# EAGLE design ProtoCAT_wireless (EAGLE 6.5.0)
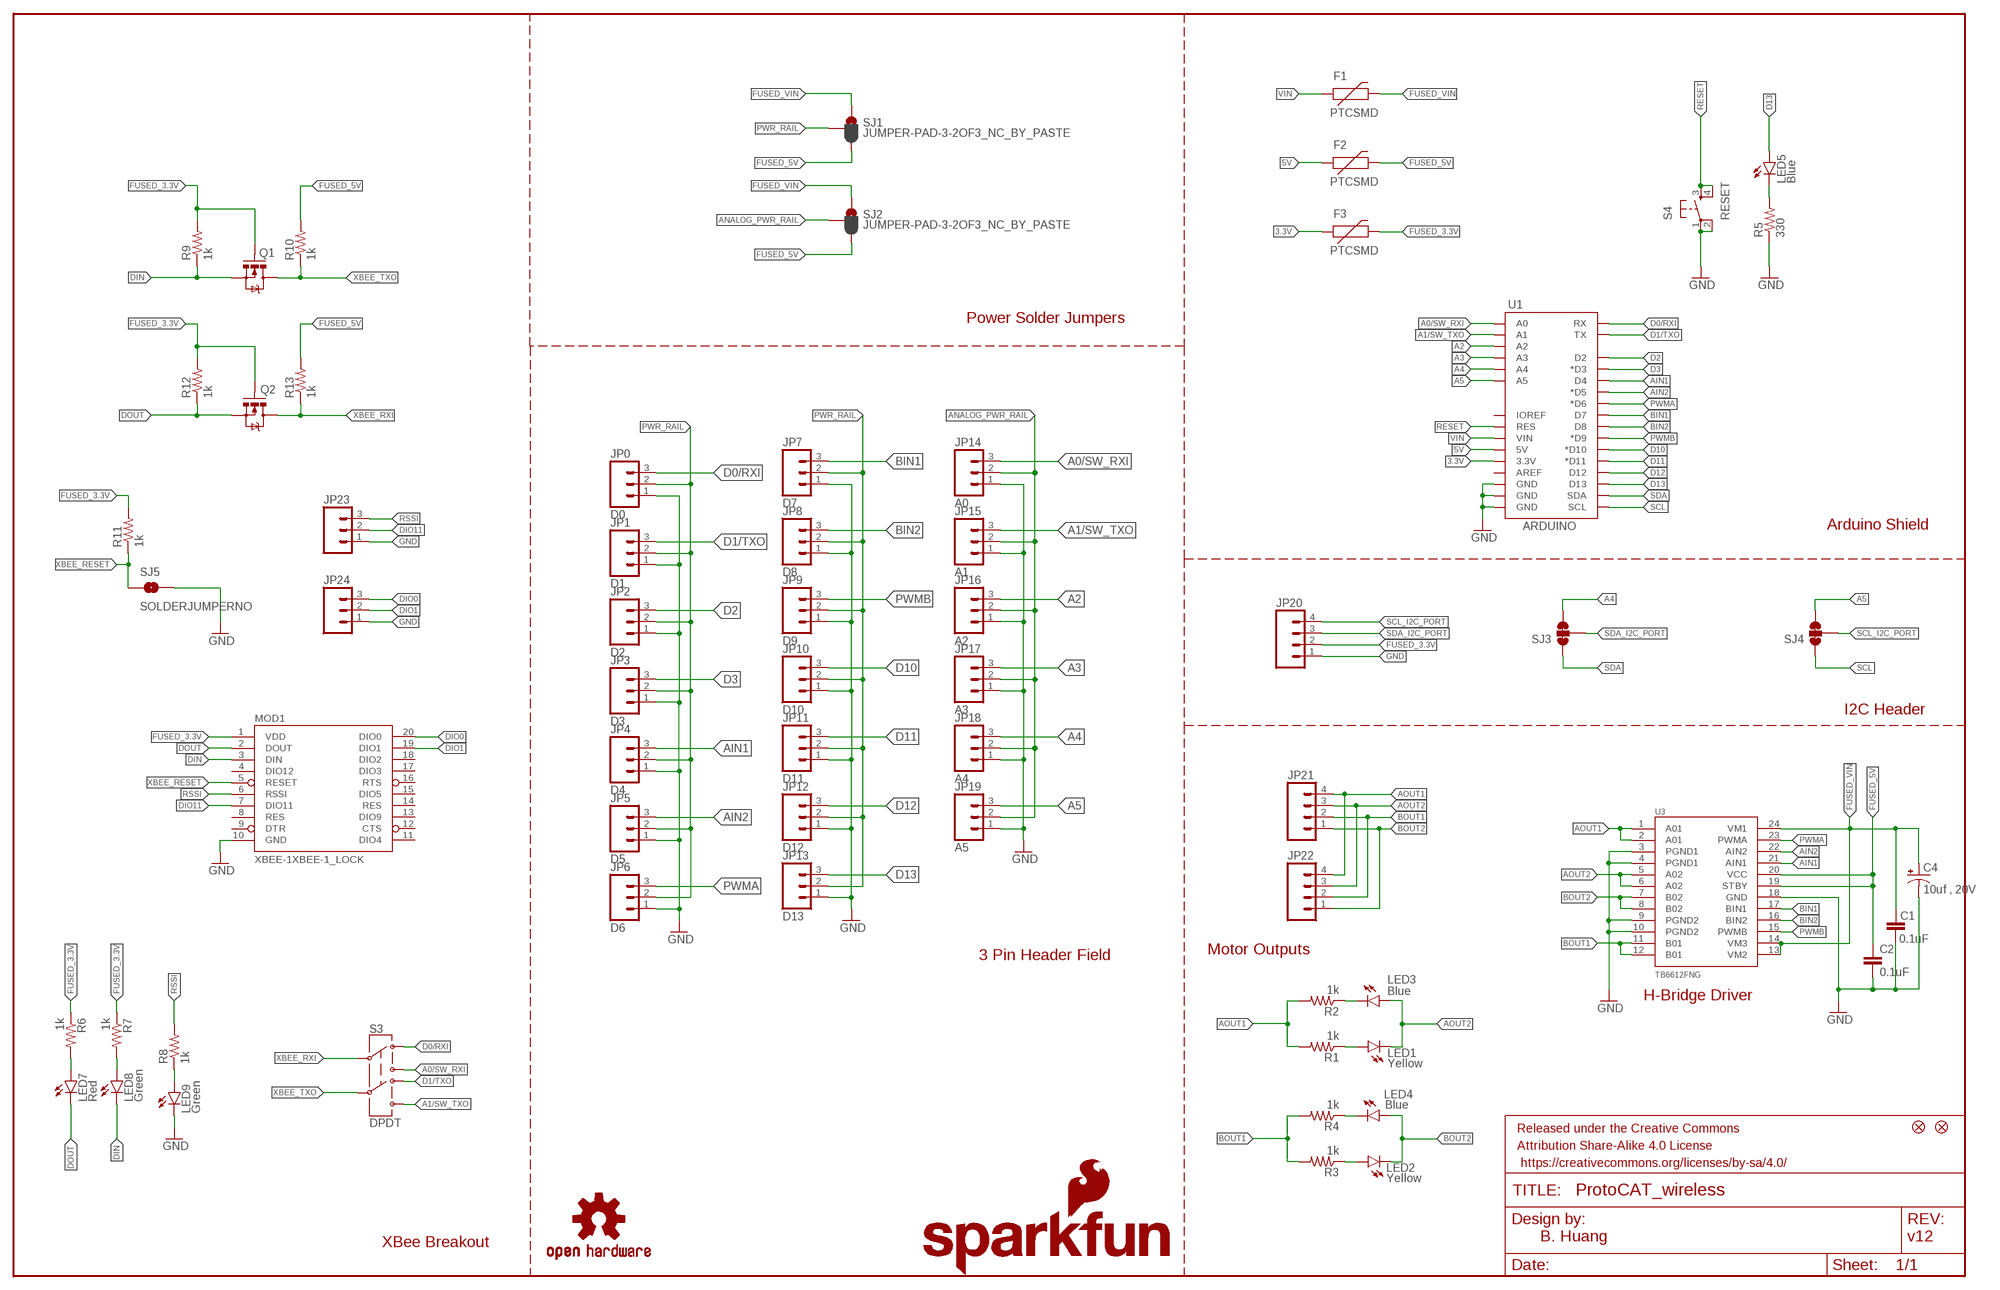
[diagram p0: schematic, sheet 1]

## Parts
C1  0.1uF  0.1UF-25V-5%(0603)  [0603-CAP]
C2  0.1uF  0.1UF-25V-5%(0603)  [0603-CAP]
C4  10uf , 20V  10UF-20V-10%(TANT)  [EIA3528]
F1  PTCSMD  [PTC-1206]
F2  PTCSMD  [PTC-1206]
F3  PTCSMD  [PTC-1206]
FID1  FIDUCIAL1X2  [FIDUCIAL-1X2]
FID2  FIDUCIAL1X2  [FIDUCIAL-1X2]
FRAME1  FRAME-LEDGER  [CREATIVE_COMMONS]
JP0  D0  M03LOCK  [1X03_LOCK]
JP1  D1  M03LOCK  [1X03_LOCK]
JP2  D2  M03LOCK  [1X03_LOCK]
JP3  D3  M03LOCK  [1X03_LOCK]
JP4  D4  M03LOCK  [1X03_LOCK]
JP5  D5  M03LOCK  [1X03_LOCK]
JP6  D6  M03LOCK  [1X03_LOCK]
JP7  D7  M03LOCK  [1X03_LOCK]
JP8  D8  M03LOCK  [1X03_LOCK]
JP9  D9  M03LOCK  [1X03_LOCK]
JP10  D10  M03LOCK  [1X03_LOCK]
JP11  D11  M03LOCK  [1X03_LOCK]
JP12  D12  M03LOCK  [1X03_LOCK]
JP13  D13  M03LOCK  [1X03_LOCK]
JP14  A0  M03LOCK  [1X03_LOCK]
JP15  A1  M03LOCK  [1X03_LOCK]
JP16  A2  M03LOCK  [1X03_LOCK]
JP17  A3  M03LOCK  [1X03_LOCK]
JP18  A4  M03LOCK  [1X03_LOCK]
JP19  A5  M03LOCK  [1X03_LOCK]
JP20  M04PTH  [1X04]
JP21  M04PTH  [1X04]
JP22  M04SMD_STRAIGHT_COMBO  [1X04_SMD_STRAIGHT_COMBO]
JP23  M031X03_NO_SILK  [1X03_NO_SILK]
JP24  M031X03_NO_SILK  [1X03_NO_SILK]
LED1  Yellow  LED0603  [LED-0603]
LED2  Yellow  LED0603  [LED-0603]
LED3  Blue  LED0603  [LED-0603]
LED4  Blue  LED0603  [LED-0603]
LED5  Blue  LED0603  [LED-0603]
LED7  Red  LED-RED0603  [LED-0603]
LED8  Green  LED-GREEN0603  [LED-0603]
LED9  Green  LED-GREEN0603  [LED-0603]
LOGO1  OSHW-LOGOM  [OSHW-LOGO-M]
LOGO2  SFE_LOGO_NAME_FLAME.1_INCH  [SFE_LOGO_NAME_FLAME_.1]
LOGO3  SFE_LOGO_FLAME.2COP  [SFE_LOGO_FLAME_COPPER_.2]
LOGO4  SFE_LOGO_NAME_FLAME.1_INCH  [SFE_LOGO_NAME_FLAME_.1]
MOD1  XBEE-1XBEE-1_LOCK  [XBEE-1_LOCK]
Q1  MOSFET-NCHANNELSMD  [SOT23-3]
Q2  MOSFET-NCHANNELSMD  [SOT23-3]
R1  1k  1KOHM1/10W1%(0603)  [0603-RES]
R2  1k  1KOHM1/10W1%(0603)  [0603-RES]
R3  1k  1KOHM1/10W1%(0603)  [0603-RES]
R4  1k  1KOHM1/10W1%(0603)  [0603-RES]
R5  330  330OHM1/10W1%(0603)  [0603-RES]
R6  1k  1KOHM1/10W1%(0603)  [0603-RES]
R7  1k  1KOHM1/10W1%(0603)  [0603-RES]
R8  1k  1KOHM1/10W1%(0603)  [0603-RES]
R9  1k  1KOHM1/10W1%(0603)  [0603-RES]
R10  1k  1KOHM1/10W1%(0603)  [0603-RES]
R11  1k  1KOHM1/10W1%(0603)  [0603-RES]
R12  1k  1KOHM1/10W1%(0603)  [0603-RES]
R13  1k  1KOHM1/10W1%(0603)  [0603-RES]
S3  DPDT  SWITCH-DPDTAYZ0202  [AYZ0202]
S4  RESET  TAC_SWITCHSMD  [TACTILE-SWITCH-SMD]
SJ1  JUMPER-PAD-3-2OF3_NC_BY_PASTE  [PAD-JUMPER-3-2OF3_NC_BY_PASTE_YES_SILK_FULL_BOX]
SJ2  JUMPER-PAD-3-2OF3_NC_BY_PASTE  [PAD-JUMPER-3-2OF3_NC_BY_PASTE_YES_SILK_FULL_BOX]
SJ3  JUMPER-PAD-3-NC_BY_TRACE  [PAD-JUMPER-3-3OF3_NC_BY_TRACE_YES_SILK_FULL_BOX]
SJ4  JUMPER-PAD-3-NC_BY_TRACE  [PAD-JUMPER-3-3OF3_NC_BY_TRACE_YES_SILK_FULL_BOX]
SJ5  SOLDERJUMPERNO  [SJ_2S-NO]
U1  ARDUINO  ARDUINO_R3_SHIELDNOLABELS  [UNO_R3_SHIELD_NOLABELS]
U3  TB6612FNG  [SSOP24]
U$1  SFE_LUDUS  [SFE_LUDUS-M]

## Nets
3.3V: F3.1 U1.3.3V
5V: F2.1 U1.5V
A0/SW_RXI: JP14.3 S3.3 U1.A0
A1/SW_TXO: JP15.3 S3.6 U1.A1
A2: JP16.3 U1.A2
A3: JP17.3 U1.A3
A4: JP18.3 SJ3.3 U1.A4
A5: JP19.3 SJ4.3 U1.A5
AIN1: JP4.3 U1.D4 U3.21(AIN1)
AIN2: JP5.3 U1.D5(*D5) U3.22(AIN2)
ANALOG_PWR_RAIL: JP14.2 JP15.2 JP16.2 JP17.2 JP18.2 JP19.2 SJ2.2
AOUT1: JP21.4 JP22.4 R1.2 R2.2 U3.1(A01) U3.2(A01)
AOUT2: JP21.3 JP22.3 LED1.C LED3.A U3.5(A02) U3.6(A02)
BIN1: JP7.3 U1.D7 U3.17(BIN1)
BIN2: JP8.3 U1.D8 U3.16(BIN2)
BOUT1: JP21.2 JP22.2 R3.2 R4.2 U3.11(B01) U3.12(B01)
BOUT2: JP21.1 JP22.1 LED2.C LED4.A U3.7(B02) U3.8(B02)
D0/RXI: JP0.3 S3.1 U1.RX
D1/TXO: JP1.3 S3.4 U1.TX
D2: JP2.3 U1.D2
D3: JP3.3 U1.D3(*D3)
D10: JP10.3 U1.D10(*D10)
D11: JP11.3 U1.D11(*D11)
D12: JP12.3 U1.D12
D13: JP13.3 LED5.A U1.D13
DIN: LED8.C MOD1.3(DIN) Q1.2(S) R9.1
DIO0: JP24.3 MOD1.20(DIO0)
DIO1: JP24.2 MOD1.19(DIO1)
DIO11: JP23.2 MOD1.7(DIO11)
DOUT: LED7.C MOD1.2(DOUT) Q2.2(S) R12.1
FUSED_3.3V: F3.2 JP20.2 MOD1.1(VDD) Q1.1(G) Q2.1(G) R6.1 R7.1 R9.2 R11.2 R12.2
FUSED_5V: C2.1 F2.2 R10.2 R13.2 SJ1.3 SJ2.3 U3.19(STBY) U3.20(VCC)
FUSED_VIN: C1.1 C4.A(+) F1.2 SJ1.1 SJ2.1 U3.13(VM2) U3.14(VM3) U3.24(VM1)
GND: C1.2 C2.2 C4.C(-) JP0.1 JP1.1 JP2.1 JP3.1 JP4.1 JP5.1 JP6.1 JP7.1 JP8.1 JP9.1 JP10.1 JP11.1 JP12.1 JP13.1 JP14.1 JP15.1 JP16.1 JP17.1 JP18.1 JP19.1 JP20.1 JP23.1 JP24.1 LED9.C MOD1.10(GND) R5.1 S4.1 S4.2 SJ5.2 U1.GND@0(GND) U1.GND@1(GND) U1.GND@2(GND) U3.3(PGND1) U3.4(PGND1) U3.9(PGND2) U3.10(PGND2) U3.18(GND)
N$1: LED5.C R5.2
N$4: LED1.A R1.1
N$5: LED3.C R2.1
N$8: LED2.A R3.1
N$9: LED4.C R4.1
N$22: LED7.A R6.2
N$43: LED8.A R7.2
N$44: LED9.A R8.1
PWMA: JP6.3 U1.D6(*D6) U3.23(PWMA)
PWMB: JP9.3 U1.D9(*D9) U3.15(PWMB)
PWR_RAIL: JP0.2 JP1.2 JP2.2 JP3.2 JP4.2 JP5.2 JP6.2 JP7.2 JP8.2 JP9.2 JP10.2 JP11.2 JP12.2 JP13.2 SJ1.2
RESET: S4.3 S4.4 U1.RES
RSSI: JP23.3 MOD1.6(RSSI) R8.2
SCL: SJ4.1 U1.SCL
SCL_I2C_PORT: JP20.4 SJ4.2
SDA: SJ3.1 U1.SDA
SDA_I2C_PORT: JP20.3 SJ3.2
VIN: F1.1 U1.VIN
XBEE_RESET: MOD1.5(RESET) R11.1 SJ5.1
XBEE_RXI: Q2.3(D) R13.1 S3.2
XBEE_TXO: Q1.3(D) R10.1 S3.5
Unconnected: MOD1.4(DIO12) MOD1.8(RES) MOD1.9(DTR) MOD1.11(DIO4) MOD1.12(CTS) MOD1.13(DIO9) MOD1.14(RES) MOD1.15(DIO5) MOD1.16(RTS) MOD1.17(DIO3) MOD1.18(DIO2) U1.AREF U1.IOREF

## Notes on the sheet
- Power Solder Jumpers
- Arduino Shield
- I2C Header
- Motor Outputs
- 3 Pin Header Field
- H-Bridge Driver
- B. Huang | v12
- XBee Breakout

## Library data of the parts
C1 C2 = SparkFun-Capacitors:0.1UF-25V-5%(0603): CAP-08604; PROD_ID: CAP-08604
C4 = SparkFun-Capacitors:10UF-20V-10%(TANT): CAP-08063; PROD_ID: CAP-08063; VALUE: 10uF
F1-F3 = SparkFun-PowerIC:PTC: Resettable Fuse PTC Resettable Fuse. Spark Fun Electronics SKU : COM-08357; PROD_ID: RES-11150
FID1 FID2 = SparkFun-Aesthetics:FIDUCIAL: Fiducial Alignment Points Various fiducial points for machine vision alignment.
FRAME1 = SparkFun-Aesthetics:FRAME-LEDGER: Schematic Frame Standard 11x14 US Ledger frame
JP0 JP1-JP19 JP23 JP24 = SparkFun-Connectors:M03: Header 3 Standard 3-pin 0.1" header. Use with straight break away headers (SKU : PRT-00116), right angle break away headers (PRT-00553), swiss pins (PRT-00743), machine pins (PRT-00117), and female headers (PRT-00115). Molex polarized connector foot print use with SKU : PRT-08232 with associated crimp pins and housings.
JP20 JP21 = SparkFun-Connectors:M04: Header 4 Standard 4-pin 0.1" header. Use with straight break away headers (SKU : PRT-00116), right angle break away headers (PRT-00553), swiss pins (PRT-00743), machine pins (PRT-00117), and female headers (PRT-00115). Molex polarized connector foot print use with SKU : PRT-08231 with associated crimp pins and housings. 1MM SMD Version SKU: PRT-10208
JP22 = SparkFun-Connectors:M04: Header 4 Standard 4-pin 0.1" header. Use with straight break away headers (SKU : PRT-00116), right angle break away headers (PRT-00553), swiss pins (PRT-00743), machine pins (PRT-00117), and female headers (PRT-00115). Molex polarized connector foot print use with SKU : PRT-08231 with associated crimp pins and housings. 1MM SMD Version SKU: PRT-10208; PROD_ID: CONN-08511; VALUE: 1X04_SMD_STRAIGHT_COMBO
LED1-LED5 = SparkFun-LED:LED: LEDs Standard schematic elements and footprints for 5mm, 3mm, 1206, and 0603 sized LEDs. 5mm - Spark Fun Electronics SKU : COM-00529 (and others)
LED7 = SparkFun-LED:LED-RED: Assorted Red LEDs LilyPad 1206- DIO-09912 1206- DIO-00809 0603- DIO-00819; PROD_ID: DIO-00819; VALUE: RED
LED8 LED9 = SparkFun-LED:LED-GREEN: Various green LEDs Green LEDs used in SFE Production 0603- DIO-00821 LARGE- DIO-00862 LILYPAD- DIO-09910; PROD_ID: DIO-00821; VALUE: GREEN
LOGO1 = SparkFun-Aesthetics:OSHW-LOGO: Open Source Hardware Logo This logo indicates the piece of hardware it is found on incorporates a OSHW license and/or adheres to the definition of open source hardware found here: http://freedomdefined.org/OSHW
LOGO2 LOGO4 = SparkFun-Aesthetics:SFE_LOGO_NAME_FLAME: SFE Logo, name and flame This is the SparkFun full logo. The logo on the schematic will always be the same size; the package variant is the height of the flame part of the logo. Default layer for the logo on the board is tSilk.
LOGO3 = SparkFun-Aesthetics:SFE_LOGO_FLAME: SFE Logo, flame only This is the SparkFun flame logo. The logo on the schematic will always be the same size; the package variant is the height of the flame. Default layer for the logo on the board is tSilk.
MOD1 = SparkFun-RF:XBEE-1: Xbee module footprints SMT header is CONN-09042.
Q1 Q2 = SparkFun-DiscreteSemi:MOSFET-NCHANNEL: Generic NMOS footprint
R1-R4 R6-R13 = SparkFun-Resistors:1KOHM1/10W1%(0603): RES-07856; PROD_ID: RES-07856; VALUE: 1K
R5 = SparkFun-Resistors:330OHM1/10W1%(0603): RES-00818; PROD_ID: RES-00818
S3 = SparkFun-Electromechanical:SWITCH-DPDT: DPDT Version of the COM-00597; PROD_ID: SWCH-08179
S4 = SparkFun-Electromechanical:TAC_SWITCH: Momentary Switch Button commonly used for reset or general input. Spark Fun Electronics SKU : COM-00097 SMT- SWCH-08247; PROD_ID: SWCH-08247; VALUE: TAC_SWITCHSMD
SJ1 SJ2 = SparkFun-Passives:JUMPER-PAD-3-2OF3_NC_BY_PASTE
SJ3 SJ4 = SparkFun-Passives:JUMPER-PAD-3-NC_BY_TRACE
SJ5 = SparkFun-Retired:SOLDERJUMPER: Solder Jumper Standard SMD solder jumper. Used to automate production. Two varients : Normally Open and Normally Closed are the same, but have different paste layers. NC will have a large amount of paste and should jumper during reflow.
U1 = SparkFun-Boards:ARDUINO_R3_SHIELD: Shield form compatible with the Arduino Uno R3.
U3 = SparkFun-PowerIC:TB6612FNG: Toshiba 1A dual motor driver IC-09363; PROD_ID: IC-09363
U$1 = SparkFun-Aesthetics:SFE_LUDUS

## Net classes
1 vcc: width 0.305 mm

## Board
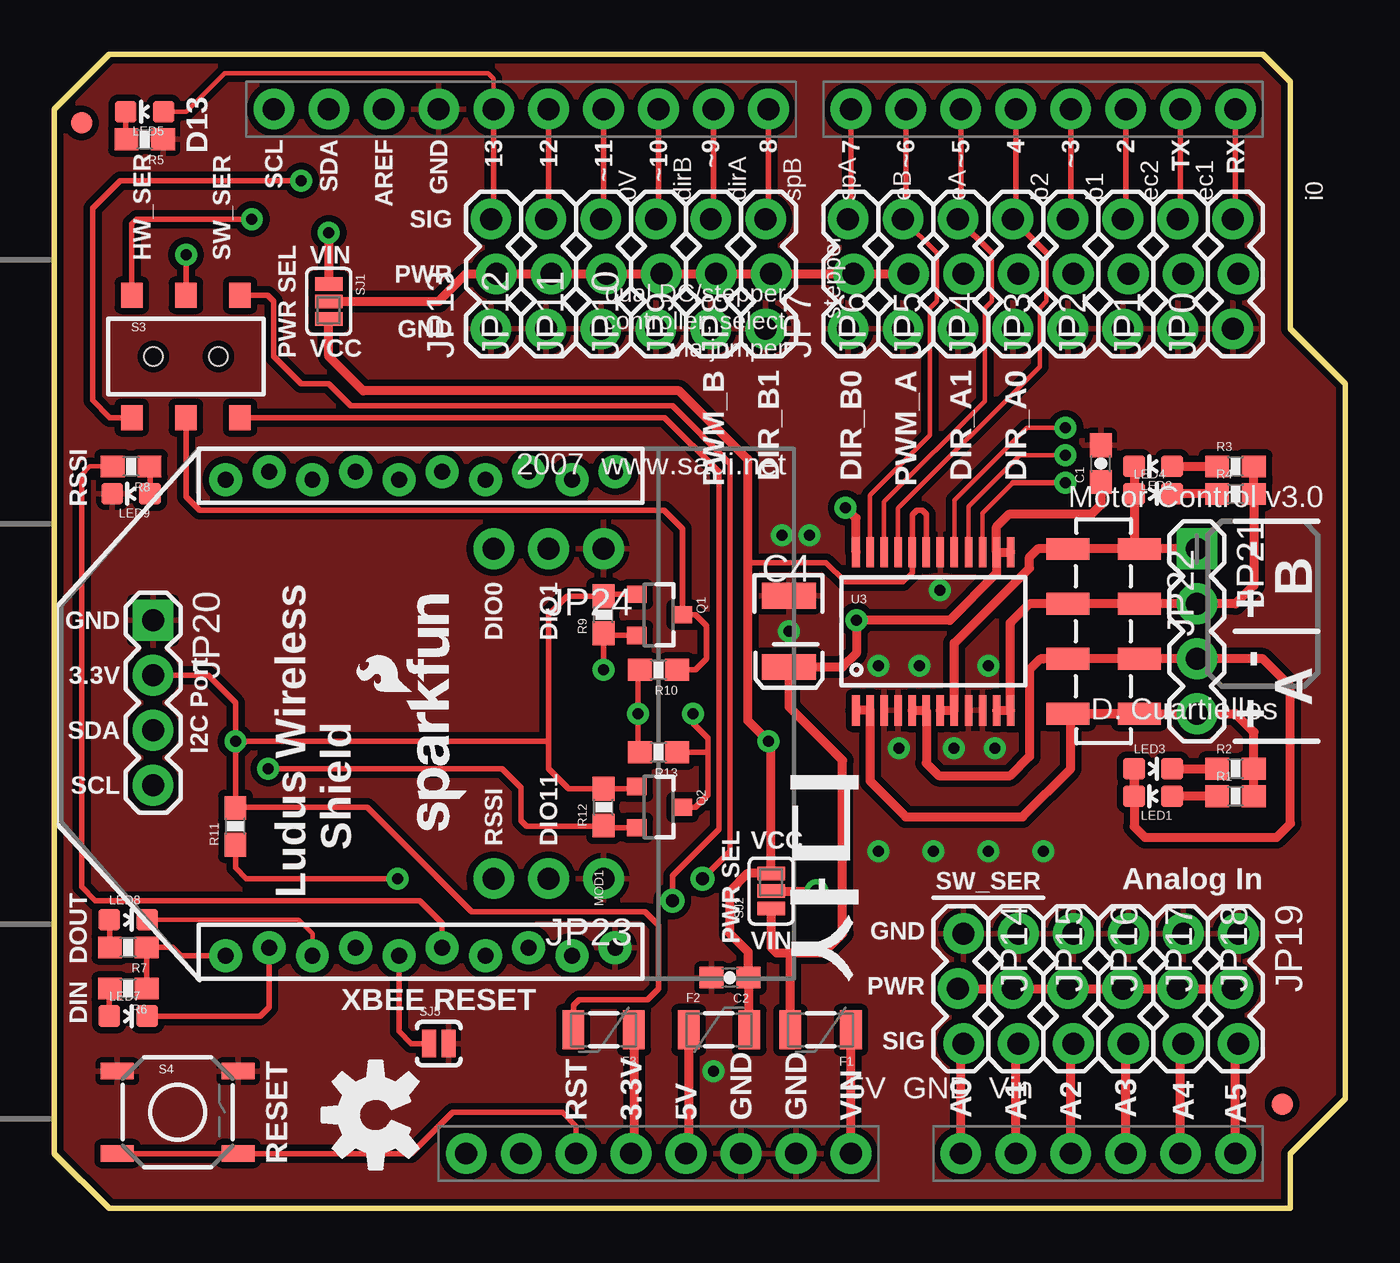
[diagram p1: board, top side]
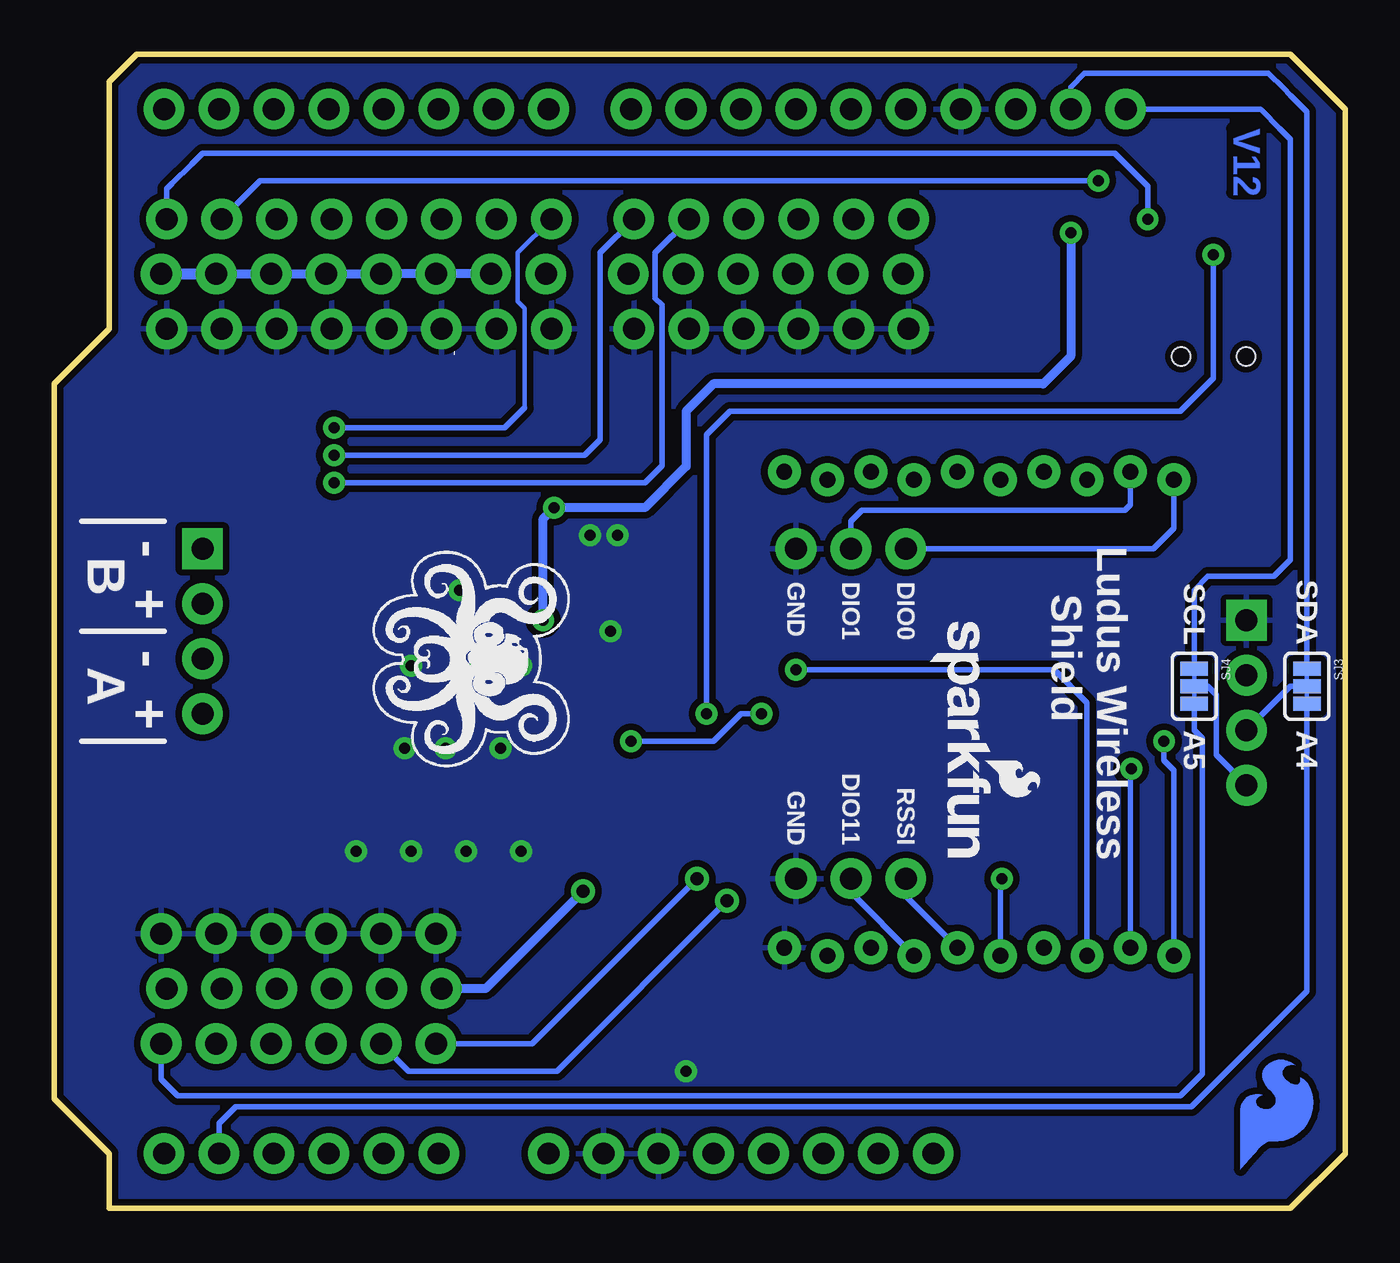
[diagram p2: board, bottom side, seen from below]

Size 59.69 x 53.34 mm. Coordinates in mm from the lower left corner, seen from the top.
Outline: 0,50.8 0,2.54 2.54,0 57.15,0 57.15,2.54 59.69,5.08 59.69,38.1 57.15,40.64 57.15,52.07 55.88,53.34 2.54,53.34 0,50.8
Copper layers (1*16): Top 0.035mm / dielectric 1.5mm / Bottom 0.035mm
Design rules "SparkFun-2-layer": minimum track width 7mil, minimum drill 15mil, track to track 8mil, track to pad 8mil, pad to pad 8mil, via to via 8mil, smd to smd 8mil, copper to edge 8mil, drill to drill 8mil, minimum pad ring 12mil, minimum via ring 10mil, stop-mask expansion 4mil, vias tented up to drill 20mil, thermal gap 10mil

### Footprints (pad centres in the part's own frame; a part is rotated, then mirrored left to right if it is on the bottom)
0603-CAP = smd 1.1 x 1: 1 -0.85,0; 2 0.85,0
EIA3528 = smd 1.2 x 2.5: A 1.65,0; C -1.65,0
PTC-1206 = smd 1 x 1.8: 1 -1.4,0; 2 1.4,0
FIDUCIAL-1X2 = smd 1 x 1: 1 0,0
1X03_LOCK = drill 1.016 pad 1.88: 1 0,0.127; 2 2.54,-0.127; 3 5.08,0.127
1X04 = drill 1.016 pad 1.88 square: 1 0,0 | drill 1.016 pad 1.88: 2 2.54,0; 3 5.08,0; 4 7.62,0
1X04_SMD_STRAIGHT_COMBO = smd 1 x 2: 1 0,-1.65; 1-2 0,1.65; 2 2.54,1.65; 2-2 2.54,-1.65; 3 5.08,-1.65; 3-2 5.08,1.65; 4 7.62,1.65; 4-2 7.62,-1.65
1X03_NO_SILK = drill 1.016 pad 1.88: 1 0,0; 2 2.54,0; 3 5.08,0
LED-0603 = smd 1 x 1: A 0,-0.877; C 0,0.877
XBEE-1_LOCK = drill 0.737 pad 1.524: 1 -11.178,20; 2 -10.822,18; 3 -11.178,16; 4 -10.822,14; 5 -11.178,12; 6 -10.822,10; 7 -11.178,8; 8 -10.822,6; 9 -11.178,4; 10 -10.822,2; 11 11.178,2; 12 10.822,4; 13 11.178,6; 14 10.822,8; 15 11.178,10; 16 10.822,12; 17 11.178,14; 18 10.822,16; 19 11.178,18; 20 10.822,20
SOT23-3 = smd 0.8 x 0.9: 1 -0.95,-1; 2 0.95,-1; 3 0,1.1
0603-RES = smd 1.1 x 1: 1 -0.85,0; 2 0.85,0
AYZ0202 = smd 1 x 1.15: 1 -2.5,2.825; 2 0,2.825; 3 2.5,2.825; 4 -2.5,-2.825; 5 0,-2.825; 6 2.5,-2.825 | hole 0.85: 1.5,0; -1.5,0
TACTILE-SWITCH-SMD = smd 1.524 x 0.762: 1 -2.794,1.905; 2 2.794,1.905; 3 -2.794,-1.905; 4 2.794,-1.905
PAD-JUMPER-3-2OF3_NC_BY_PASTE_YES_SILK_FULL_BOX = smd 0.635 x 1.27: 1 -0.813,0; 2 0,0; 3 0.813,0
PAD-JUMPER-3-3OF3_NC_BY_TRACE_YES_SILK_FULL_BOX = smd 0.635 x 1.27: 1 -0.813,0; 2 0,0; 3 0.813,0
SJ_2S-NO = smd 0.635 x 1.27: 1 -0.45,0; 2 0.45,0
UNO_R3_SHIELD_NOLABELS = drill 1.016 pad 1.88: 3.3V 50.8,26.67; 5V 50.8,29.21; A0 50.8,41.91; A1 50.8,44.45; A2 50.8,46.99; A3 50.8,49.53; A4 50.8,52.07; A5 50.8,54.61; AREF 2.54,15.24; D2 2.54,49.53; D3 2.54,46.99; D4 2.54,44.45; D5 2.54,41.91; D6 2.54,39.37; D7 2.54,36.83; D8 2.54,33.02; D9 2.54,30.48; D10 2.54,27.94; D11 2.54,25.4; D12 2.54,22.86; D13 2.54,20.32; GND@0 50.8,31.75; GND@1 50.8,34.29; GND@2 2.54,17.78; IOREF 50.8,21.59; NC 50.8,19.05; RES 50.8,24.13; RX 2.54,54.61; SCL 2.54,10.16; SDA 2.54,12.7; TX 2.54,52.07; VIN 50.8,36.83
SSOP24 = smd 0.348 x 1.397: 1 -3.575,-3.656; 2 -2.925,-3.656; 3 -2.275,-3.656; 4 -1.625,-3.656; 5 -0.975,-3.656; 6 -0.325,-3.656; 7 0.325,-3.656; 8 0.975,-3.656; 9 1.625,-3.656; 10 2.275,-3.656; 11 2.925,-3.656; 12 3.575,-3.656; 13 3.575,3.656; 14 2.925,3.656; 15 2.275,3.656; 16 1.625,3.656; 17 0.975,3.656; 18 0.325,3.656; 19 -0.325,3.656; 20 -0.975,3.656; 21 -1.625,3.656; 22 -2.275,3.656; 23 -2.925,3.656; 24 -3.575,3.656

### Placement (x,y rotation side)
C1  48.39,34.42 90 top
C2  31.24,10.67 180 top
C4  33.97,26.67 270 top
F1  35.43,8.26 180 top
F2  30.73,8.26 0 top
F3  25.4,8.26 180 top
FID1  1.27,50.16 0 top
FID2  56.77,4.83 0 top
FRAME1  -3.81,-10.16 0 top  (outside the outline)
JP0  54.61,40.64 90 top
JP1  52.07,40.64 90 top
JP2  49.53,40.64 90 top
JP3  46.99,40.64 90 top
JP4  44.45,40.64 90 top
JP5  41.91,40.64 90 top
JP6  39.37,40.64 90 top
JP7  36.83,40.64 90 top
JP8  33.02,40.64 90 top
JP9  30.48,40.64 90 top
JP10  27.94,40.64 90 top
JP11  25.4,40.64 90 top
JP12  22.86,40.64 90 top
JP13  20.32,40.64 90 top
JP14  41.91,12.7 270 top
JP15  44.45,12.7 270 top
JP16  46.99,12.7 270 top
JP17  49.53,12.7 270 top
JP18  52.07,12.7 270 top
JP19  54.61,12.7 270 top
JP20  4.57,27.18 270 top
JP21  52.83,30.48 270 top
JP22  48.51,30.48 270 top
JP23  25.4,15.24 180 top
JP24  25.4,30.48 180 top
LED1  50.8,19.05 90 top
LED2  50.8,34.29 90 top
LED3  50.8,20.32 270 top
LED4  50.8,33.02 270 top
LED5  4.19,50.67 90 top
LED7  3.43,8.89 270 top
LED8  3.43,13.34 270 top
LED9  3.56,33.02 90 top
LOGO1  14.86,4.32 90 top
LOGO2  19.18,17.02 90 top
LOGO3  5.21,1.52 0 bottom
LOGO4  19.3,27.56 270 bottom
MOD1  27.94,22.86 90 top
Q1  27.94,27.43 270 top
Q2  27.94,18.54 270 top
R1  54.61,19.05 0 top
R2  54.61,20.32 0 top
R3  54.61,34.29 0 top
R4  54.61,33.02 0 top
R5  4.19,49.4 180 top
R6  3.43,10.16 180 top
R7  3.43,12.06 180 top
R8  3.56,34.29 180 top
R9  25.4,27.43 90 top
R10  27.94,24.89 180 top
R11  8.38,17.65 90 top
R12  25.4,18.54 90 top
R13  27.94,21.08 180 top
S3  6.1,39.37 0 top
S4  5.71,4.45 0 top
SJ1  12.7,41.91 270 top
SJ2  33.15,14.67 90 top
SJ3  1.78,24.13 270 bottom
SJ4  6.99,24.13 270 bottom
SJ5  17.78,7.62 0 top
U1  0,53.34 270 top
U3  40.64,26.67 0 top
U$1  40.64,25.4 90 top

### Tracks (layer width: path | path; a pad name or v marks a point on that pad's centre or on a via)
3.3V
  Top 0.406: F3.1 26.8,2.67 U1.3.3V
5V
  Top 0.406: F2.1 29.33,2.66 U1.5V
A0/SW_RXI  (via drill 0.6)
  Top 0.254: S3.3 9.88,42.2 10.16,41.91 10.16,39.37 11.43,38.1 12.7,38.1 13.72,37.08 28.57,37.08 31.24,34.42 31.24,16.51 v29.97,15.24
  Top 0.406: U1.A0 41.91,7.49 JP14.3
  Bottom 0.254: JP14.3 37.59,7.62 v29.97,15.24
A1/SW_TXO  (via drill 0.6)
  Top 0.254: S3.6 28.23,36.55 30.73,34.04 30.73,17.53 28.57,15.37 v28.57,14.22
  Top 0.406: U1.A1 44.45,7.49 JP15.3
  Bottom 0.254: JP15.3 43.31,6.35 36.45,6.35 v28.57,14.22
A2
  Top 0.406: U1.A2 46.99,7.49 JP16.3
A3
  Top 0.406: U1.A3 49.53,7.49 JP17.3
A4
  Top 0.406: U1.A4 52.07,7.49 JP18.3
  Bottom 0.254: U1.A4 52.07,3.94 51.31,4.7 7.11,4.7 4,7.81 2.54,9.27 1.78,10.03 SJ3.3
A5
  Top 0.406: U1.A5 54.61,7.49 JP19.3
  Bottom 0.254: JP19.3 54.74,5.97 53.98,5.21 7.62,5.21 6.6,6.22 6.6,21.72 6.99,22.1 SJ4.3
AIN1
  Top 0.203: U3.21 39.02,32.35 45.56,38.89 45.56,41.59 45.88,41.91 45.88,44.16
  Top 0.254: U1.D4 44.45,45.85 JP4.3 45.88,44.16
AIN2
  Top 0.203: U3.22 38.37,32.65 43.02,37.31 43.02,41.59 43.34,41.91 43.34,44.16
  Top 0.254: U1.D5 41.91,45.85 JP5.3 43.34,44.16
ANALOG_PWR_RAIL  (via drill 0.6)
  Top 0.406: JP14.2 JP15.2 JP16.2 JP17.2 JP18.2 JP19.2 | SJ2.2 v35.24,14.67
  Bottom 0.406: v35.24,14.67 39.75,10.16 JP14.2
AOUT1
  Top 0.254: 55.24,18.84 R1.2
  Top 0.406: R1.2 R2.2 55.46,22.01 54.61,22.86 JP21.4 JP22.4 46.99,22.86 46.99,20.32 44.77,18.1 39.37,18.1 37.72,19.75 U3.2 U3.1
AOUT2
  Top 0.406: LED1.C LED3.A 49.92,17.64 50.42,17.14 56.52,17.14 57.15,17.78 57.15,24.13 55.88,25.4 53.34,25.4 JP21.3 JP22.3 45.72,25.4 45.59,25.4 45.09,24.89 45.09,20.89 44.2,20 40.89,20 40.31,20.58 U3.6 U3.5
BIN1  (via drill 0.51)
  Top 0.203: U3.17 41.62,32.73 44.96,36.07 v46.76,36.07
  Top 0.254: U1.D7 36.83,45.85 JP7.3
  Bottom 0.203: 37.94,36.99 37.94,41.59 38.26,41.91 38.26,44.16 JP7.3
  Bottom 0.254: 37.94,36.99 38.86,36.07 v46.76,36.07
BIN2  (via drill 0.51)
  Top 0.203: U3.16 42.27,32.42 44.64,34.8 v46.76,34.8
  Top 0.254: U1.D8 33.02,45.85 JP8.3
  Bottom 0.254: v46.76,34.8 35.18,34.8 34.45,35.53 34.45,44.16 JP8.3
BOUT1
  Top 0.406: R3.2 R4.2 55.46,28.79 54.61,27.94 JP21.2 JP22.2 45.09,27.94 44.22,27.07 44.22,27.03 | U3.11 U3.12 44.22,27.03 | 44.22,27.03 44.2,27.05
BOUT2
  Top 0.406: U3.7 U3.8 41.62,26.12 45.09,29.59 45.09,30.1 45.47,30.48 JP22.1 49.92,30.48 | LED2.C LED4.A 49.92,30.48 | JP21.1 49.92,30.48
D0/RXI  (via drill 0.51)
  Top 0.254: S3.1 3.6,45.51 3.81,45.72 v9.14,45.72 | U1.RX 54.61,45.85 JP0.3
  Bottom 0.254: JP0.3 54.48,47.12 54.23,47.37 53.34,48.26 52.83,48.77 10.67,48.77 9.14,47.24 v9.14,45.72
D1/TXO  (via drill 0.51)
  Top 0.254: v11.43,47.5 3.05,47.5 1.78,46.23 1.78,37.34 2.57,36.55 S3.4 | U1.TX 52.07,45.85 JP1.3
  Bottom 0.254: v11.43,47.5 50.16,47.5 JP1.3
D2
  Top 0.254: U1.D2 49.53,45.85 JP2.3
D3
  Top 0.254: U1.D3 46.99,45.85 JP3.3
D10
  Top 0.254: U1.D10 27.94,45.85 JP10.3
D11
  Top 0.254: U1.D11 25.4,45.85 JP11.3
D12
  Top 0.254: U1.D12 22.86,45.85 JP12.3
D13
  Top 0.203: U1.D13 20.32,52.2 20.07,52.45 7.87,52.45 6.1,50.67 LED5.A
  Top 0.254: U1.D13 20.32,45.85 JP13.3
DIN  (via drill 0.51)
  Top 0.203: MOD1.3 11.94,12.7 11.3,13.34 LED8.C
  Top 0.254: Q1.2 25.5,26.48 R9.1 v25.4,24.89
  Bottom 0.254: MOD1.3 11.94,23.37 13.46,24.89 v25.4,24.89
DIO0
  Bottom 0.254: MOD1.20 7.94,31.43 8.89,30.48 JP24.3
DIO1
  Bottom 0.254: MOD1.19 9.94,32.51 10.19,32.26 22.35,32.26 22.86,31.75 JP24.2
DIO11
  Bottom 0.254: MOD1.7 22.86,14.6 JP23.2
DOUT  (via drill 0.51)
  Top 0.254: Q2.2 25.5,17.59 R12.1 25.36,17.65 21.84,17.65 21.59,17.91 21.59,19.43 20.7,20.32 v9.91,20.32 | MOD1.2 9.94,9.3 9.53,8.89 LED7.C
  Bottom 0.254: MOD1.2 9.94,20.29 v9.91,20.32
FUSED_3.3V  (via drill 0.51)
  Top 0.254: Q1.1 25.5,28.38 R9.2 23.71,28.28 22.86,27.43 22.86,21.59 | Q2.1 26.84,19.39 R12.2 23.79,19.39 22.86,20.32 22.86,21.59 | 8.89,21.59 v8.38,21.59 8.38,23.37 7.11,24.64 JP20.2 | 8.89,21.59 22.86,21.59 | R6.1 R7.1 5.46,12.06 5.84,11.68 MOD1.1 | F3.2 24,9.39 24.26,9.65 27.43,9.65 27.94,10.16 27.94,13.08 27.3,13.72 19.3,13.72 14.48,18.54 8.38,18.54 | R11.2 8.38,18.54 | 8.38,18.54 8.38,21.08 8.89,21.59
  Bottom 0.254: MOD1.1 7.94,20.26 8.38,20.7 v8.38,21.59
FUSED_5V  (via drill 0.51)
  Top 0.254: U3.19 40.31,32.08 40.13,32.26 39.88,32.26 39.66,32.05 U3.20 39.66,29.38 39.24,28.96 36.58,28.96 35.69,29.84 32.05,29.84 | R13.2 26.99,21.18 v26.99,22.86 26.99,24.79 R10.2
  Top 0.406: SJ1.3 12.7,39.37 14.29,37.78 28.89,37.78 32.05,34.62 32.05,29.84 32.05,22.55 v33.02,21.59 33.15,21.46 SJ2.3 32.05,15.48 31.24,14.67 31.24,12.7 32.09,11.85 C2.1 32.09,8.3 F2.2
  Bottom 0.254: v26.99,22.86 27.94,22.86 29.21,21.59 v33.02,21.59
FUSED_VIN  (via drill 0.51)
  Top 0.406: U3.24 37.06,31.9 v36.58,32.38 | U3.14 43.56,29.34 41.4,27.18 v37.08,27.18 37.08,25.65 36.45,25.02 C4.A 33.97,23.18 36.45,20.7 36.45,12.7 35.56,11.81 34.03,11.81 | U3.14 U3.13 | C1.1 48.39,32.51 47.94,32.07 44.13,32.07 43.56,31.5 U3.14 | v12.7,45.09 SJ1.1 | F1.2 34.03,11.81 | SJ2.1 33.15,12.06 33.4,11.81 34.03,11.81
  Bottom 0.406: v12.7,45.09 12.7,39.37 13.97,38.1 29.21,38.1 30.48,36.83 30.48,34.29 32.38,32.38 v36.58,32.38 37.08,31.88 v37.08,27.18
GND  (via drill 0.51)
  other vias: 43.18,25.08 40.01,25.08 39.05,21.27 30.48,6.35 38.1,16.51 43.18,16.51 41.59,21.27 45.72,16.51 40.64,16.51 40.96,28.57 33.66,31.11 34.92,31.11 33.97,26.67 43.5,21.27 38.1,25.08
  pour Top (isolate 0.305): 0,53.34 0,0 59.69,0 59.69,53.34
  pour Bottom (isolate 0.305): 0,0 59.69,0 59.69,53.34 0,53.34
N$1
  Top 0.203: LED5.C 3.31,50.7
  Top 0.254: LED5.C 3.31,49.43 R5.2
N$4
  Top 0.406: R1.1 LED1.A
N$5
  Top 0.406: LED3.C R2.1
N$8
  Top 0.406: LED2.A R3.1
N$9
  Top 0.406: R4.1 LED4.C
N$22
  Top 0.254: R6.2 2.55,10.16 LED7.A
N$43
  Top 0.254: LED8.A 2.58,13.34 R7.2
N$44
  Top 0.254: LED9.A 4.43,34.26 R8.1
PWMA
  Top 0.203: U3.23 37.72,32.95 40.48,35.72 40.48,41.59 40.8,41.91 40.8,44.16 JP6.3
  Top 0.254: U1.D6 39.37,45.85 JP6.3
PWMB  (via drill 0.51)
  Top 0.203: U3.15 42.91,32.12 44.32,33.53
  Top 0.254: v46.76,33.53 44.32,33.53 | U1.D9 30.48,45.85 JP9.3
  Bottom 0.254: v46.76,33.53 32.38,33.53 31.59,34.32 31.59,41.75 31.91,42.07 31.91,44.16 JP9.3
PWR_RAIL
  Top 0.406: SJ1.2 17.78,41.91 19.05,43.18 JP13.2 JP12.2 JP11.2 JP10.2 JP9.2 JP8.2 JP7.2 JP6.2
  Bottom 0.406: JP6.2 JP5.2 JP4.2 JP3.2 JP2.2 JP1.2
  Bottom 0.508: JP0.2 JP1.2
RESET
  Top 0.254: S4.3 S4.4 16.51,2.54 18.41,4.45 23.5,4.45 24.13,3.81 U1.RES
RSSI
  Top 0.203: R8.2 1.65,34.29 1.27,33.91
  Top 0.254: 1.27,33.91 1.27,14.86 1.91,14.22 16.89,14.22 17.94,13.18 MOD1.6
  Bottom 0.254: MOD1.6 20.32,14.42 JP23.3
SCL
  Bottom 0.254: U1.SCL 3.94,50.8 3.87,50.74 3.05,49.91 2.54,49.4 2.54,29.97 3.3,29.21 6.35,29.21 6.99,28.57 SJ4.1
SCL_I2C_PORT
  Bottom 0.254: SJ4.2 6.35,24.13 5.97,23.75 5.97,20.95 JP20.4
SDA
  Bottom 0.254: U1.SDA 12.7,51.82 12.06,52.45 3.56,52.45 2.86,51.75 2.54,51.44 1.78,50.67 SJ3.1
SDA_I2C_PORT
  Bottom 0.254: SJ3.2 2.54,24.13 JP20.3
VIN
  Top 0.406: U1.VIN F1.1
XBEE_RESET  (via drill 0.51)
  Top 0.254: MOD1.5 15.94,8.19 16.51,7.62 SJ5.1 | R11.1 8.38,15.75 8.89,15.24 v15.88,15.24
  Bottom 0.254: MOD1.5 15.94,15.18 v15.88,15.24
XBEE_RXI  (via drill 0.51)
  Top 0.254: Q2.3 29.65,18.54 30.23,19.11 30.23,21.08 | S3.2 v6.1,44.07 | 30.23,21.08 R13.1 | v29.53,22.86 29.53,22.42 30.23,21.72 30.23,21.59 30.23,21.08
  Bottom 0.254: v6.1,44.07 6.1,38.35 7.62,36.83 28.45,36.83 29.53,35.75 v29.53,22.86
XBEE_TXO
  Top 0.254: R10.1 29.65,24.89 30.16,25.4 30.16,26.92 29.65,27.43 Q1.3 29.04,31.41 28.19,32.26 6.73,32.26 6.1,32.89 S3.5

### Text on the board
Bottom: V12
tPlace: D13 | SCL | SDA | AREF | GND | 13 | 12 | ~11 | ~10 | ~9 | 8 | 7 | ~6 | ~5 | 4 | ~3 | 2 | TX | RX | SIG | HW_SER | SW_SER | VIN | PWR | PWR SEL | GND | VCC | PWM_B | DIR_B1 | DIR_B0 | PWM_A | DIR_A1 | DIR_A0 | RSSI | - | DIO0 | DIO1 | B | + | GND | 3.3V | - | A | I2C Port | + | SDA | SCL | RSSI | DIO11 | VCC | PWR SEL | SW_SER | Analog In | Ludus Wireless / Shield | DOUT | GND | VIN | DIN | PWR | XBEE RESET | SIG | RESET | RST | 3.3V | 5V | GND | GND | VIN | A0 | A1 | A2 | A3 | A4 | A5
bPlace: Ludus Wireless / Shield | - | DIO0 | DIO1 | GND | B | + | SDA | SCL | - | A | + | A4 | A5 | RSSI | DIO11 | GND
tNames: 0V | dirB | dirA | spB | spA | eB | eA | b2 | b1 | ec2 | ec1 | i0 | dual DC/stepper | controller, select | stepper | via jumper | 2007 www.sadi.net | Motor Control v3.0 | D. Cuartielles | 5V GND Vin
tValues: L298P013TR
tDocu: B. Huang